# Altium schematic sheet Top Level.SchDoc
size A4
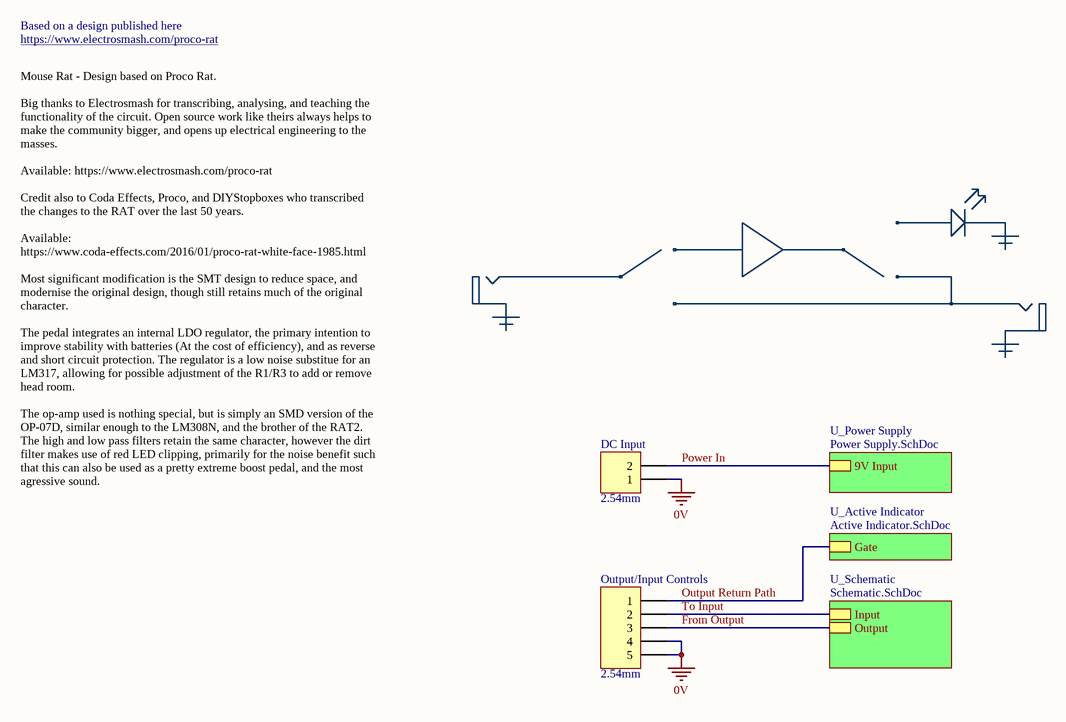
[diagram p0: Top Level.SchDoc]

## Parts
DC_Input  2.54mm  [TH 2.54mm Header 1x2]
Output/Input_Controls  2.54mm  [TH 2.54mm Header 1x5]

## Sub-sheets
U_Active Indicator = Active Indicator.SchDoc: Gate
U_Power Supply = Power Supply.SchDoc: 9V Input
U_Schematic = Schematic.SchDoc: Output, Input

## Nets
0V: DC_Input.1 Output/Input_Controls.4 Output/Input_Controls.5
From Output: Output/Input_Controls.3 ; sheet U_Schematic/Output
Output Return Path: Output/Input_Controls.1 ; sheet U_Active Indicator/Gate
Power In: DC_Input.2 ; sheet U_Power Supply/9V Input
To Input: Output/Input_Controls.2 ; sheet U_Schematic/Input

## Notes on the sheet
- https://www.electrosmash.com/proco-rat
- Based on a design published here
- Mouse Rat - Design based on Proco Rat.
  Big thanks to Electrosmash for transcribing, analysing, and teaching the functionality of the circuit. Open source work like theirs always helps to make the community bigger, and opens up electrical engineering to the masses.
  Available: https://www.electrosmash.com/proco-rat
  Credit also to Coda Effects, Proco, and DIYStopboxes who transcribed the changes to the RAT over the last 50 years.
  Available: https://www.coda-effects.com/2016/01/proco-rat-white-face-1985.html
  Most significant modification is the SMT design to reduce space, and modernise the original design, though still retains much of the original character.
  The pedal integrates an internal LDO regulator, the primary intention to improve stability with batteries (At the cost of efficiency), and as reverse and short circuit protection. The regulator is a low noise substitue for an LM317, allowing for possible adjustment of the R1/R3 to add or remove head room.
  The op-amp used is nothing special, but is simply an SMD version of the OP-07D, similar enough to the LM308N, and the brother of the RAT2. The high and low pass filters retain the same character, however the dirt filter makes use of red LED clipping, primarily for the noise benefit such that this can also be used as a pretty extreme boost pedal, and the most agressive sound.

## Library data of the parts
DC_Input = TH 2.54mm Header 1x2: Positions: 2; Angle: 0; Flange: No; Contact: NA; Part Number: TH 2.54mm Header 1x2; Pitch: 2.54mm; Row Spacing: 2.54mm
Output/Input_Controls = TH 2.54mm Header 1x5: Positions: 5; Angle: 0; Flange: No; Contact: NA; Part Number: TH 2.54mm Header 1x5; Pitch: 2.54mm; Row Spacing: 2.54mm